# Altium schematic sheet PowerPath.SchDoc
size A4; SheetNumber: 9; SheetTotal: 10
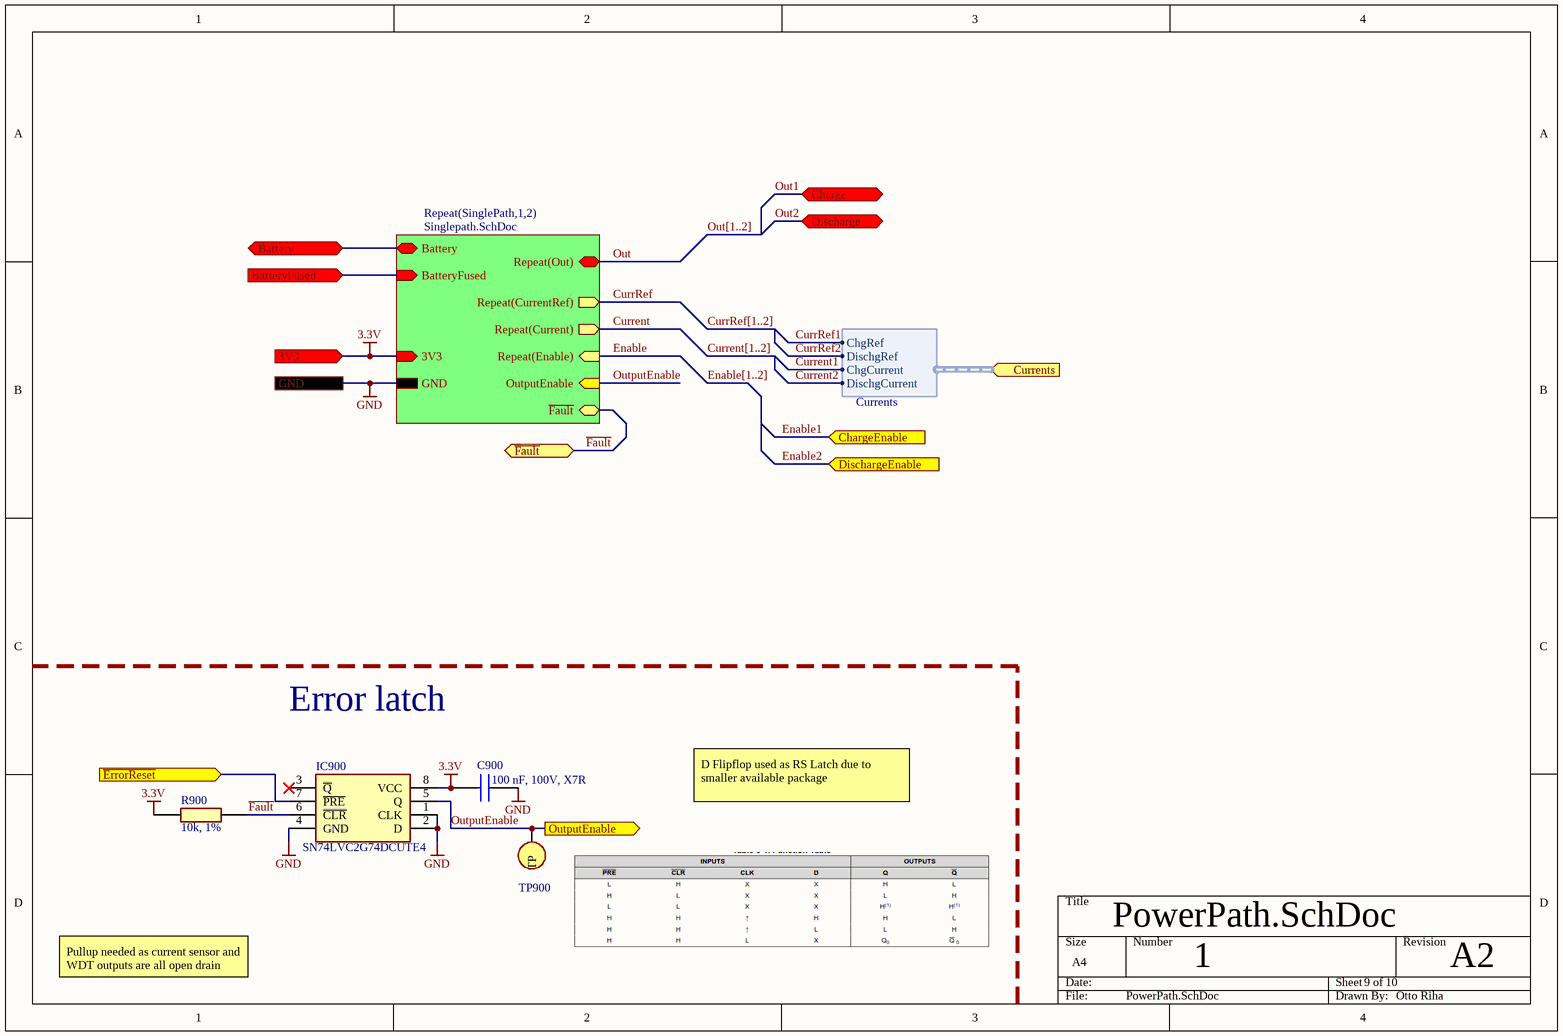
[diagram p0: PowerPath.SchDoc]

## Parts
C900  100 nF, 100V, X7R  [MAJx16]
IC900  SN74LVC2G74DCUTE4  [SOP50P310X90-8N]
R900  value 10k, 1%  [RESC1608X50N]  (hidden comment: CRCW060310K0FKEI)
TP900  Testpoint  [Testpoint]  (value not drawn)

## Sub-sheets
Repeat(SinglePath,1,2) = Singlepath.SchDoc: GND, Battery (bidir), Repeat(Out) (bidir), Repeat(CurrentRef) (out), Repeat(Current) (out), Repeat(Enable) (in), ~{Fault} (bidir), 3V3 (in), BatteryFused (in), OutputEnable (in)

## Ports
3V3 (in, see Main[4B], AuxSupply_USB[2D], MCU[1A], Singlepath[1B]), Battery (bidir, see Main[4A], Singlepath[2B]), BatteryFused (in, see Main[4B], Singlepath[2C]), Charge (bidir, see Main[5A]), ChargeEnable (in, see Main[5B]), Currents (in, harness Currents, see Main[5B], MCU[3B]), Discharge (bidir, see Main[5B]), DischargeEnable (in, see Main[5B]), GND (see Main[4B], AuxSupply_USB[1C], LTC_Hardware[1D], MCU[1A], Singlepath[1C]), OutputEnable (out, see Main[5B], MCU[3C], Singlepath[2C]), ~{ErrorReset} (in, see Main[5B], MCU[3C]), ~{Fault} (bidir, see Main[5B], Singlepath[1B])

## Harnesses
Currents: DischgCurrent, DischgRef, ChgRef, ChgCurrent

## Nets
3.3V: C900.1 IC900.8(VCC) R900.1 ; port 3V3, sheet Repeat(SinglePath,1,2)/3V3
GND: C900.2 IC900.1(CLK) IC900.2(D) IC900.4(GND) ; port GND, sheet Repeat(SinglePath,1,2)/GND
Battery: port Battery, sheet Repeat(SinglePath,1,2)/Battery
BatteryFused: port BatteryFused, sheet Repeat(SinglePath,1,2)/BatteryFused
Current: sheet Repeat(SinglePath,1,2)/Repeat(Current)
Current1: port Currents.ChgCurrent
Current2: port Currents.DischgCurrent
CurrRef: sheet Repeat(SinglePath,1,2)/Repeat(CurrentRef)
CurrRef1: port Currents.ChgRef
CurrRef2: port Currents.DischgRef
~{ErrorReset}: IC900.7(~{PRE}) ; port ~{ErrorReset}
Enable: sheet Repeat(SinglePath,1,2)/Repeat(Enable)
Enable1: port ChargeEnable
Enable2: port DischargeEnable
~{Fault}: IC900.6(~{CLR}) R900.2 ; port ~{Fault}, sheet Repeat(SinglePath,1,2)/~{Fault}
Out: sheet Repeat(SinglePath,1,2)/Repeat(Out)
Out1: port Charge
Out2: port Discharge
OutputEnable: IC900.5(Q) TP900.1(TP) ; port OutputEnable, sheet Repeat(SinglePath,1,2)/OutputEnable

Not connected (* = marked no-connect by the designer): IC900 3(~{Q})*

## Buses and harness runs
bus Current[1..2]
bus CurrRef[1..2]
bus Enable[1..2]
bus Out[1..2]

## Notes on the sheet
- Error latch
- D Flipflop used as RS Latch due to smaller available package
- Pullup needed as current sensor and WDT outputs are all open drain
- 1
- A2
- Otto Riha

## Library data of the parts
C900 = MAJCH168BB7104KTEA01: Capacitor 100nF, 100V, X7R; Manufacturer_Name: TAIYO YUDEN; Datasheet Link: https://ds.yuden.co.jp/TYCOMPAS/or/detail?pn=MAJCH168BB7104KTEA01; Height: 0.8mm; Manufacturer_Part_Number: MAJCH168BB7104KTEA01; Mouser Part Number: 963-MAJCH168BB7104KT; Mouser Price/Stock: https://www.mouser.co.uk/ProductDetail/TAIYO-YUDEN/MAJCH168BB7104KTEA01?qs=ZcfC38r4PovaTBrG0IdezQ%3D%3D; Arrow Part Number: MAJCH168BB7104KTEA01; Arrow Price/Stock: https://www.arrow.com/en/products/majch168bb7104ktea01/taiyo-yuden?utm_currency=USD&region=nac; Supplier 1: Mouser; Supplier Part Number 1: 963-MAJCH168BB7104KT
IC900 = SN74LVC2G74DCUTE4: Integrated Circuit; Manufacturer_Name: Texas Instruments; Datasheet Link: https://www.ti.com/lit/ds/symlink/sn74lvc2g74.pdf?ts=1620105032147&ref_url=https%253A%252F%252Fwww.ti.com%252Fsitesearch%252Fdocs%252Funiversalsearch.tsp%253FsearchTerm%253DSN74LVC2G74DCURE4; Height: 0.9mm; Manufacturer_Part_Number: SN74LVC2G74DCUTE4; Mouser Part Number: 595-74LVC2G74DCUTE4; Mouser Price/Stock: https://www.mouser.co.uk/ProductDetail/Texas-Instruments/SN74LVC2G74DCUTE4?qs=0smPjiIwnfLoccl5Dt0mHg%3D%3D; Arrow Part Number: SN74LVC2G74DCUTE4; Arrow Price/Stock: https://www.arrow.com/en/products/sn74lvc2g74dcute4/texas-instruments
R900 = CRCW060310K0FKEI: Resistor 10k, 1%; Manufacturer_Name: Vishay; Datasheet Link: http://www.vishay.com/docs/20035/dcrcwe3.pdf; Height: 0.5mm; Manufacturer_Part_Number: CRCW060310K0FKEI; Mouser Part Number: 71-CRCW060310K0FKEI; Mouser Price/Stock: https://www.mouser.co.uk/ProductDetail/Vishay-Dale/CRCW060310K0FKEI?qs=3qWEzBg5KnKofE%252B8acPBRA%3D%3D; Arrow Part Number: CRCW060310K0FKEI; Arrow Price/Stock: https://www.arrow.com/en/products/crcw060310k0fkei/vishay?utm_currency=USD&region=nac; Supplier 1: Mouser; Supplier Part Number 1: 71-CRCW060310K0FKEI